# EAGLE design miniecu (EAGLE 6.5.0)
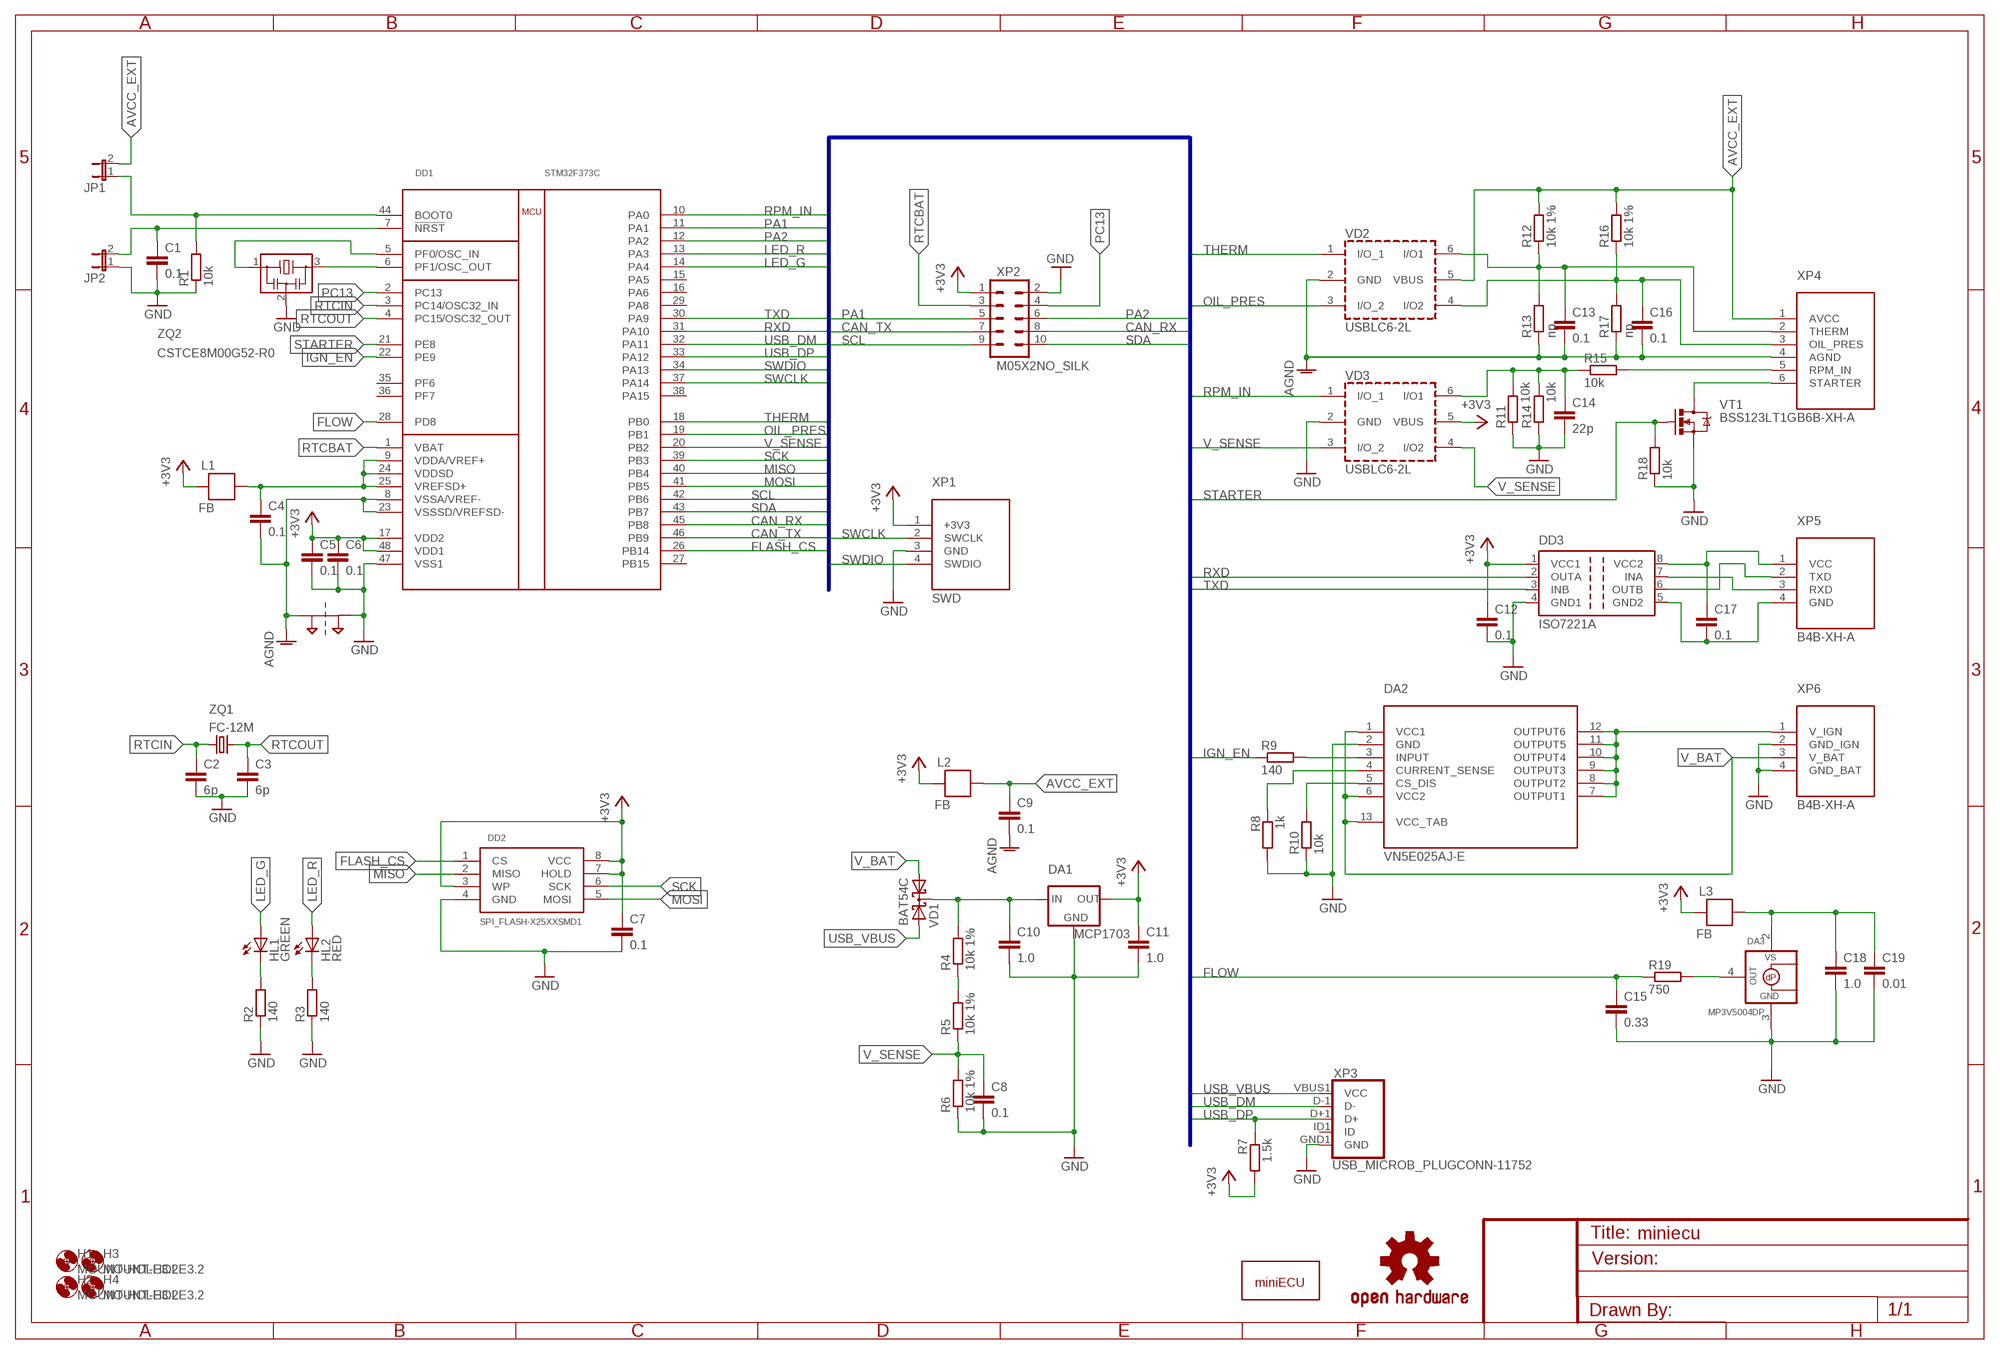
[diagram p0: schematic, sheet 1]

## Parts
C1  0.1  C-EUC0603  [C0603]
C2  6p  C-EUC0603  [C0603]
C3  6p  C-EUC0603  [C0603]
C4  0.1  C-EUC0603  [C0603]
C5  0.1  C-EUC0603  [C0603]
C6  0.1  C-EUC0603  [C0603]
C7  0.1  C-EUC0603  [C0603]
C8  0.1  C-EUC0603  [C0603]
C9  0.1  C-EUC0603  [C0603]
C10  1.0  C-EUC0805  [C0805]
C11  1.0  C-EUC0805  [C0805]
C12  0.1  C-EUC0603  [C0603]
C13  0.1  C-EUC0603  [C0603]
C14  22p  C-EUC0603  [C0603]
C15  0.33  C-EUC0603  [C0603]
C16  0.1  C-EUC0603  [C0603]
C17  0.1  C-EUC0603  [C0603]
C18  1.0  C-EUC0805  [C0805]
C19  0.01  C-EUC0603  [C0603]
DA1  MCP1703  MCP1700SOT-23  [SOT23]
DA2  VN5E025AJ-E  [POWERSSO-12]
DA3  MP3V5004DP  MPXV7025DP  [SOP8-1351]
DD1  STM32F373C  [LQFP48]
DD2  SPI_FLASH-X25XXSMD1  [SO08-EIAJ]
DD3  ISO7221A  [SO-08]
H1  MOUNT-HOLE3.2  [3,2]
H2  MOUNT-HOLE3.2  [3,2]
H3  MOUNT-HOLE3.2  [3,2]
H4  MOUNT-HOLE3.2  [3,2]
HL1  GREEN  LED-GREEN0603  [LED-0603]
HL2  RED  LED-RED0603  [LED-0603]
JP1  JUMPER-2SMD-NO  [SJ_2S-NO]
JP2  JUMPER-2SMD-NO  [SJ_2S-NO]
L1  FB  [0603]
L2  FB  [0603]
L3  FB  [0603]
LOGO1  MINIECU_LOGO  [MINIECU_LOGO]
LOGO2  OSHW-LOGOL  [OSHW-LOGO-L]
PT1  2PT_GND_TIE  [2PT_GND_TIE]
R1  10k  R-EU_R0603  [R0603]
R2  140  R-EU_R0603  [R0603]
R3  140  R-EU_R0603  [R0603]
R4  10k 1%  R-EU_R0805  [R0805]
R5  10k 1%  R-EU_R0805  [R0805]
R6  10k 1%  R-EU_R0805  [R0805]
R7  1.5k  R-EU_R0603  [R0603]
R8  1k  R-EU_R0603  [R0603]
R9  140  R-EU_R0603  [R0603]
R10  10k  R-EU_R0603  [R0603]
R11  10k  R-EU_R0603  [R0603]
R12  10k 1%  R-EU_R0805  [R0805]
R13  np  R-EU_R0805  [R0805]
R14  10k  R-EU_R0603  [R0603]
R15  10k  R-EU_R0603  [R0603]
R16  10k 1%  R-EU_R0805  [R0805]
R17  np  R-EU_R0805  [R0805]
R18  10k  R-EU_R0603  [R0603]
R19  750  R-EU_R0603  [R0603]
VD1  BAT54C  [SOT23]
VD2  USBLC6-2L  USBLC6-2SC6  [SOT-23-6L]
VD3  USBLC6-2L  USBLC6-2SC6  [SOT-23-6L]
VT1  BSS123LT1G  MOSFET-NCHANNELBSS123LT1G  [SOT23]
XP1  SWD  [1X04-1.27MM]
XP2  M05X2NO_SILK  [2X5_NOSILK]
XP3  USB_MICROB_PLUGCONN-11752  [USB-B-MICRO-SMD_V03]
XP4  B6B-XH-A  SENSORS-B6B-XH-A  [B6B-XH]
XP5  B4B-XH-A  UART-B4B-XH-A  [B4B-XH]
XP6  B4B-XH-A  IGN_POWER-B4B-XH-A  [B4B-XH]
ZQ1  FC-12M  [FC-12M]
ZQ2  CSTCE8M00G52-R0  [CSTCE]

## Nets
!NRST: C1.1 DD1.7(!NRST) JP2.2
+3V3: C5.1 C6.1 C7.1 C11.1 C12.1 DA1.2(OUT) DD1.17(VDD2) DD1.48(VDD1) DD2.3(WP) DD2.7(HOLD) DD2.8(VCC) DD3.1(VCC1) L1.2 L2.2 L3.2 R7.2 VD3.5(VBUS) XP1.1(+3V3) XP2.1
AGND: C4.2 C9.2 C13.2 C16.2 DD1.8(VSSA/VREF-) DD1.23(VSSSD/VREFSD-) PT1.P$1 R13.1 R17.1 VD2.2(GND) XP4.4(AGND)
AVCC: C4.1 DD1.9(VDDA/VREF+) DD1.24(VDDSD) DD1.25(VREFSD+) L1.1
AVCC_EXT: C9.1 JP1.2 L2.1 R12.2 R16.2 VD2.5(VBUS) XP4.1(AVCC)
AVCC_FLOW: C18.1 C19.1 DA3.2(VS) L3.1
BOOT0: DD1.44(BOOT0) JP1.1 R1.2
CAN_RX: DD1.45(PB8) XP2.8
CAN_TX: DD1.46(PB9) XP2.7
FLASH_CS: DD1.26(PB14) DD2.1(CS)
FLOW: C15.1 DD1.28(PD8) R19.1
GND: C1.2 C2.2 C3.2 C5.2 C6.2 C7.2 C8.2 C10.2 C11.2 C12.2 C14.2 C15.2 C18.2 C19.2 DA1.1(GND) DA2.2(GND) DA3.3(GND) DD1.47(VSS1) DD2.4(GND) DD3.4(GND1) JP2.1 PT1.P$2 R1.1 R2.1 R3.1 R6.1 R8.2 R10.1 R11.1 R14.1 R18.1 VD3.2(GND) VT1.2(S) XP1.3(GND) XP2.2 XP3.GND1(GND) XP6.2(GND_IGN) XP6.4(GND_BAT) ZQ2.2
GND2: C17.2 DD3.5(GND2) XP5.4(GND)
IGN_EN: DD1.22(PE9) R9.1
IORXD: DD3.7(INA) XP5.3(RXD)
IOTXD: DD3.6(OUTB) XP5.2(TXD)
LED_G: DD1.14(PA4) HL1.A
LED_R: DD1.13(PA3) HL2.A
MISO: DD1.40(PB4) DD2.2(MISO)
MOSI: DD1.41(PB5) DD2.5(MOSI)
N$1: R4.1 R5.2
N$2: DA2.4(CURRENT_SENSE) R8.1
N$3: HL2.C R3.2
N$4: DA3.4(+VOUT) R19.2
N$5: HL1.C R2.2
N$6: C10.1 DA1.3(IN) R4.2 VD1.3(CC)
N$7: DA2.3(INPUT) R9.2
N$9: DA2.5(CS_DIS) R10.2
OIL_PRES: C16.1 DD1.19(PB1) R16.1 R17.2 VD2.3(I/O_2) VD2.4(I/O2) XP4.3(OIL_PRES)
OSC_IN: DD1.5(PF0/OSC_IN) ZQ2.1
OSC_OUT: DD1.6(PF1/OSC_OUT) ZQ2.3
PA1: DD1.11(PA1) XP2.5
PA2: DD1.12(PA2) XP2.6
PC13: DD1.2(PC13) XP2.4
RPM_IN: C14.1 DD1.10(PA0) R11.2 R14.2 R15.1 VD3.1(I/O_1) VD3.6(I/O1)
RPM_IN_CON: R15.2 XP4.5(RPM_IN)
RTCBAT: DD1.1(VBAT) XP2.3
RTCIN: C2.1 DD1.3(PC14/OSC32_IN) ZQ1.1
RTCOUT: C3.1 DD1.4(PC15/OSC32_OUT) ZQ1.2
RXD: DD1.31(PA10) DD3.2(OUTA)
SCK: DD1.39(PB3) DD2.6(SCK)
SCL: DD1.42(PB6) XP2.9
SDA: DD1.43(PB7) XP2.10
STARTER: DD1.21(PE8) R18.2 VT1.1(G)
STARTER_OUT: VT1.3(D) XP4.6(STARTER)
SWCLK: DD1.37(PA14) XP1.2(SWCLK)
SWDIO: DD1.34(PA13) XP1.4(SWDIO)
THERM: C13.1 DD1.18(PB0) R12.1 R13.2 VD2.1(I/O_1) VD2.6(I/O1) XP4.2(THERM)
TXD: DD1.30(PA9) DD3.3(INB)
USB_DM: DD1.32(PA11) XP3.D-1(D-)
USB_DP: DD1.33(PA12) R7.1 XP3.D+1(D+)
USB_VBUS: VD1.2(A2) XP3.VBUS1(VCC)
V_BAT: DA2.1(VCC1) DA2.6(VCC2) DA2.13(VCC_TAB) VD1.1(A1) XP6.3(V_BAT)
V_IGN: DA2.7(OUTPUT1) DA2.8(OUTPUT2) DA2.9(OUTPUT3) DA2.10(OUTPUT4) DA2.11(OUTPUT5) DA2.12(OUTPUT6) XP6.1(V_IGN)
V_SENSE: C8.1 DD1.20(PB2) R5.1 R6.2 VD3.3(I/O_2) VD3.4(I/O2)
VCC2: C17.1 DD3.8(VCC2) XP5.1(VCC)
Unconnected: DD1.15(PA5) DD1.16(PA6) DD1.27(PB15) DD1.29(PA8) DD1.35(PF6) DD1.36(PF7) DD1.38(PA15) XP3.ID1(ID)

## Buses
TXD,RXD,RPM_IN,STARTER,THERM,OIL_PRES,MISO,MOSI,SCK,FLASH_CS,IGN_EN,V_SENSE,USB_DP,USB_DM,USB_VBUS,FLOW,SWCLK,SWDIO,LED_G,LED_R,CAN_RX,CAN_TX,SCL,SDA,PA1,PA2

## Library data of the parts
C1-C19 = resistor:C-EU: CAPACITOR, European symbol
DA1 = power-ic:MCP1700: VOLTAGE REGULATOR
DA2 = power-ic:VN5E025AJ: Single channel high-side driver with analog current sense for automotive applications Features Max supply voltage VCC 41 V Operating voltage range VCC 4.5 to 28 V Max On-State resistance RON 25 mΩ Current limitation (typ) ILIMH 60 A Off state supply current IS 2 μA
DA3 = microbuilder:MPXV7025DP: PRESSURE SENSOR - Differential Input, Single-Ended Output
DD1 = stm32f373:STM32F373C: STM32F373 ARM Cortex-M4 32b MCU+FPU, up to 256KB Flash+32KB SRAM timers, 4 ADCs (12/16-bit), 3 DACs, 2 comp., 2.0-3.6 V operation
DD2 = SparkFun-DigitalIC:SPI_FLASH-X25XX: 8pin SPI Flash series x25xx. Works with devices like W25X32 and BR25L32
DD3 = texas:ISO7221: DUAL DIGITAL ISOLATORS Source: http://focus.ti.com/lit/ds/symlink/iso7221a.pdf; MPN: ISO7221AD; OC_FARNELL: 1390651; OC_NEWARK: 48M0672
H1-H4 = holes:MOUNT-HOLE: MOUNTING HOLE with drill center marker
HL1 = SparkFun-LED:LED-GREEN: Various green LEDs 0603- DIO-00821 LARGE- DIO-00862 LILYPAD- DIO-09910; PROD_ID: DIO-00821
HL2 = SparkFun-LED:LED-RED: Assorted Red LEDs LilyPad 1206- DIO-09912 1206- DIO-00809 0603- DIO-00819; PROD_ID: DIO-00819
JP1 JP2 = SparkFun-Passives:JUMPER-2: Jumper Basic 0.1" spaced jumper. Use with breakaway headers.
L1-L3 = SparkFun-Passives:FB
LOGO1 = miniecu:MINIECU_LOGO: Logo imported from bmp.
LOGO2 = SparkFun-Aesthetics:OSHW-LOGO: Open Source Hardware Logo This logo indicates the piece of hardware it is found on incorporates a OSHW license and/or adheres to the definition of open source hardware found here: http://freedomdefined.org/OSHW
PT1 = SparkFun-Passives:2PT_GND_TIE: Package for connecting two ground nets in one place.
R1-R19 = resistor:R-EU_: RESISTOR, European symbol
VD1 = diode:BAT54C: Schottky Diodes Source: Fairchild .. BAT54.pdf
VD2 VD3 = usblc6:USBLC6-2: VERY LOW CAPACITANCE ESD PROTECTION 2 line Datasheet link <http://www.st.com/web/catalog/sense_power/FM114/CL1137/SC1489/PF93353>
VT1 = SparkFun-DiscreteSemi:MOSFET-NCHANNEL: Common NMOSFET Parts MFG P/N Store ID Prod ID FDD8780 TRANS-09984 SI7820DN TRANS-11055 FDS6630A IC-08089 2N7002PW TRANS-11151 FQP30N06L COM-10213 TRANS-10060 BSS123LT1G TRANS-08345 BSS138 TRANS-00830 BS170 2N7000; PROD_ID: TRANS-08345
XP1 = miniecu-con:SWD
XP2 = SparkFun-Connectors:M05X2: Header 5x2 Standard 10-pin dual row 0.1" header. Commonly used with AVR-ISP. Use with Spark Fun Electronics SKU: PRT-00778
XP3 = SparkFun-Connectors:USB_MICROB_PLUG: USB Micro-B Plug Comes in a variety of packages. Check out Hirose's ZX-x0 line: http://www.hirose.co.jp/cataloge_hp/e24200011.pdf; PROD_ID: CONN-11752
XP4 = miniecu-con:SENSORS: JST XH CONNECTOR JST XH connector for engine sensors
XP5 = miniecu-con:UART: JST XH CONNECTOR Connector for isolated UART
XP6 = miniecu-con:IGN_POWER: JST XH CONNECTOR Connector for ingition module power switch
ZQ1 = crystal:FC-12M: kHz RANGE CRYSTAL UNIT LOW PROFILE SMD Source: Epson Toyocom FC-12M.pdf
ZQ2 = cstce-resonator:CSTC?: Resonator CSTCR ­- 2.0 x 4.5 mm <http://search.murata.co.jp/Ceramy/CatalogAction.do?sHinnm=?&nbsp&sNHinnm=CSTCR6M00G53-R0&sNhin_key=CSTCR6M00G53-R0&sLang=en&sParam=CSTCR> CSTCE ­- 1.3 x 3.2 mm <http://search.murata.co.jp/Ceramy/CatalogAction.do?sHinnm=?&nbsp&sNHinnm=CSTCE8M00G52-R0&sNhin_key=CSTCE8M00G52-R0&sLang=en&sParam=CSTCE>; FREQUENCY: 8 MHz; OC_MOUSER: 81-CSTCE8M00G52-R0

## Board
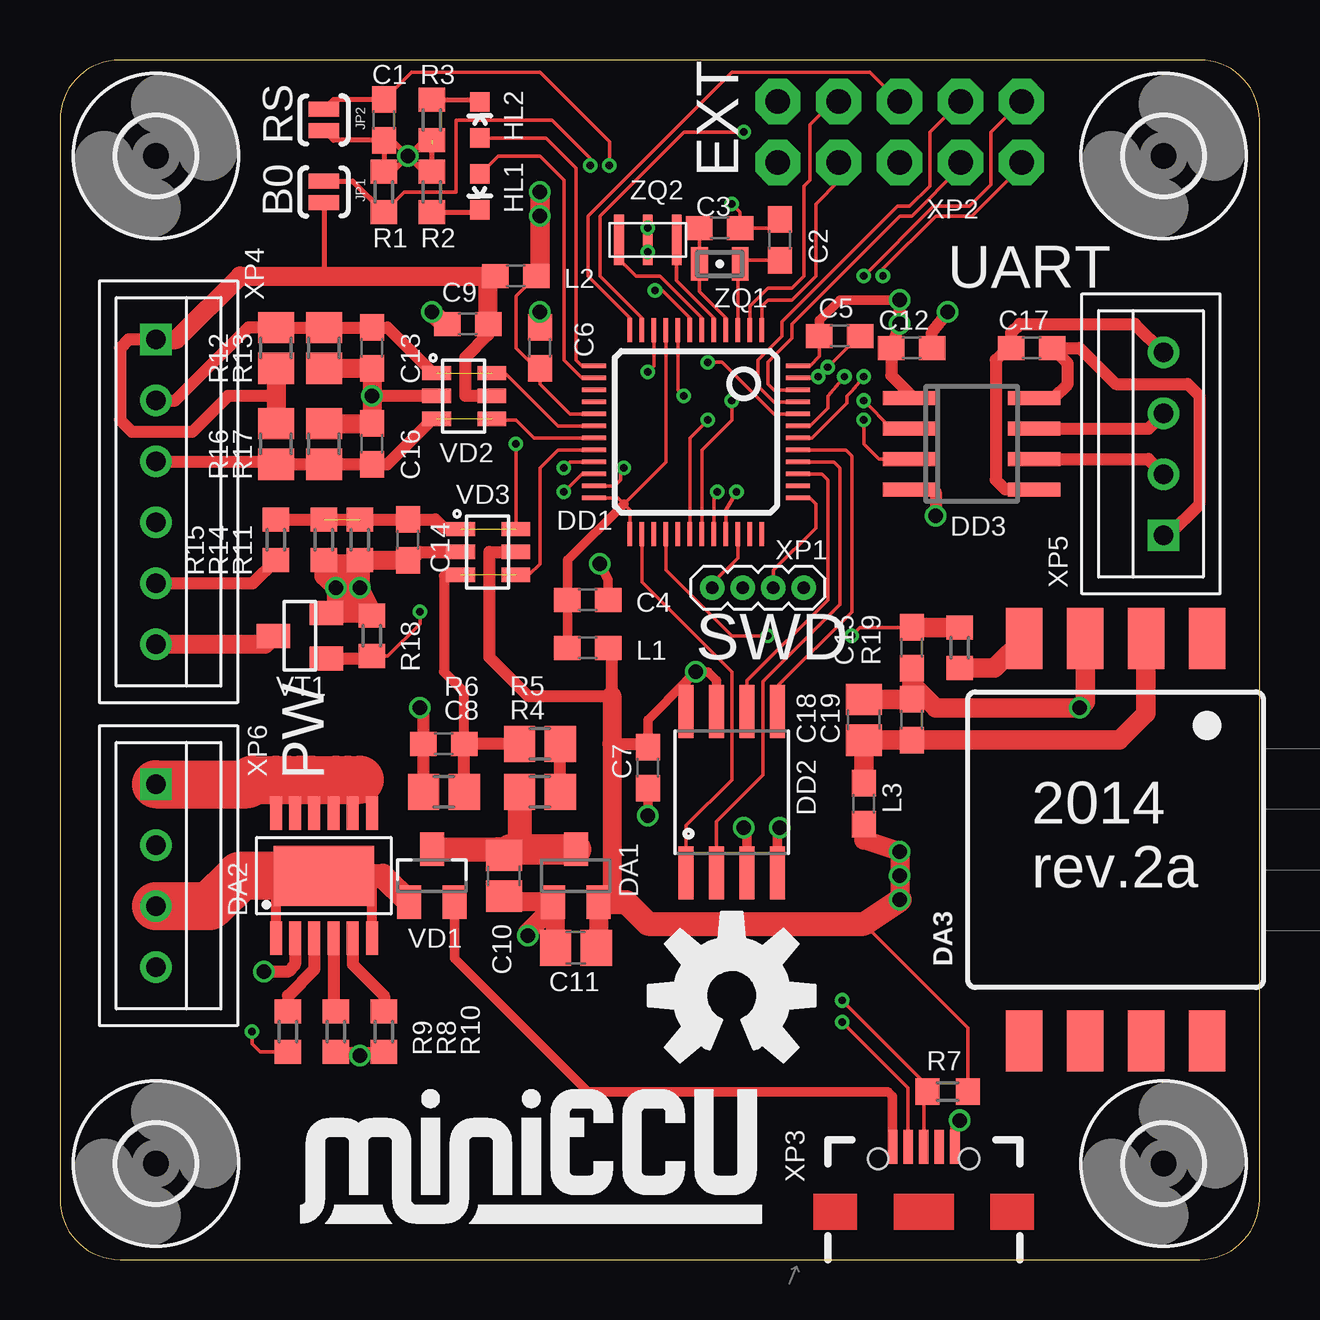
[diagram p1: board, top side]
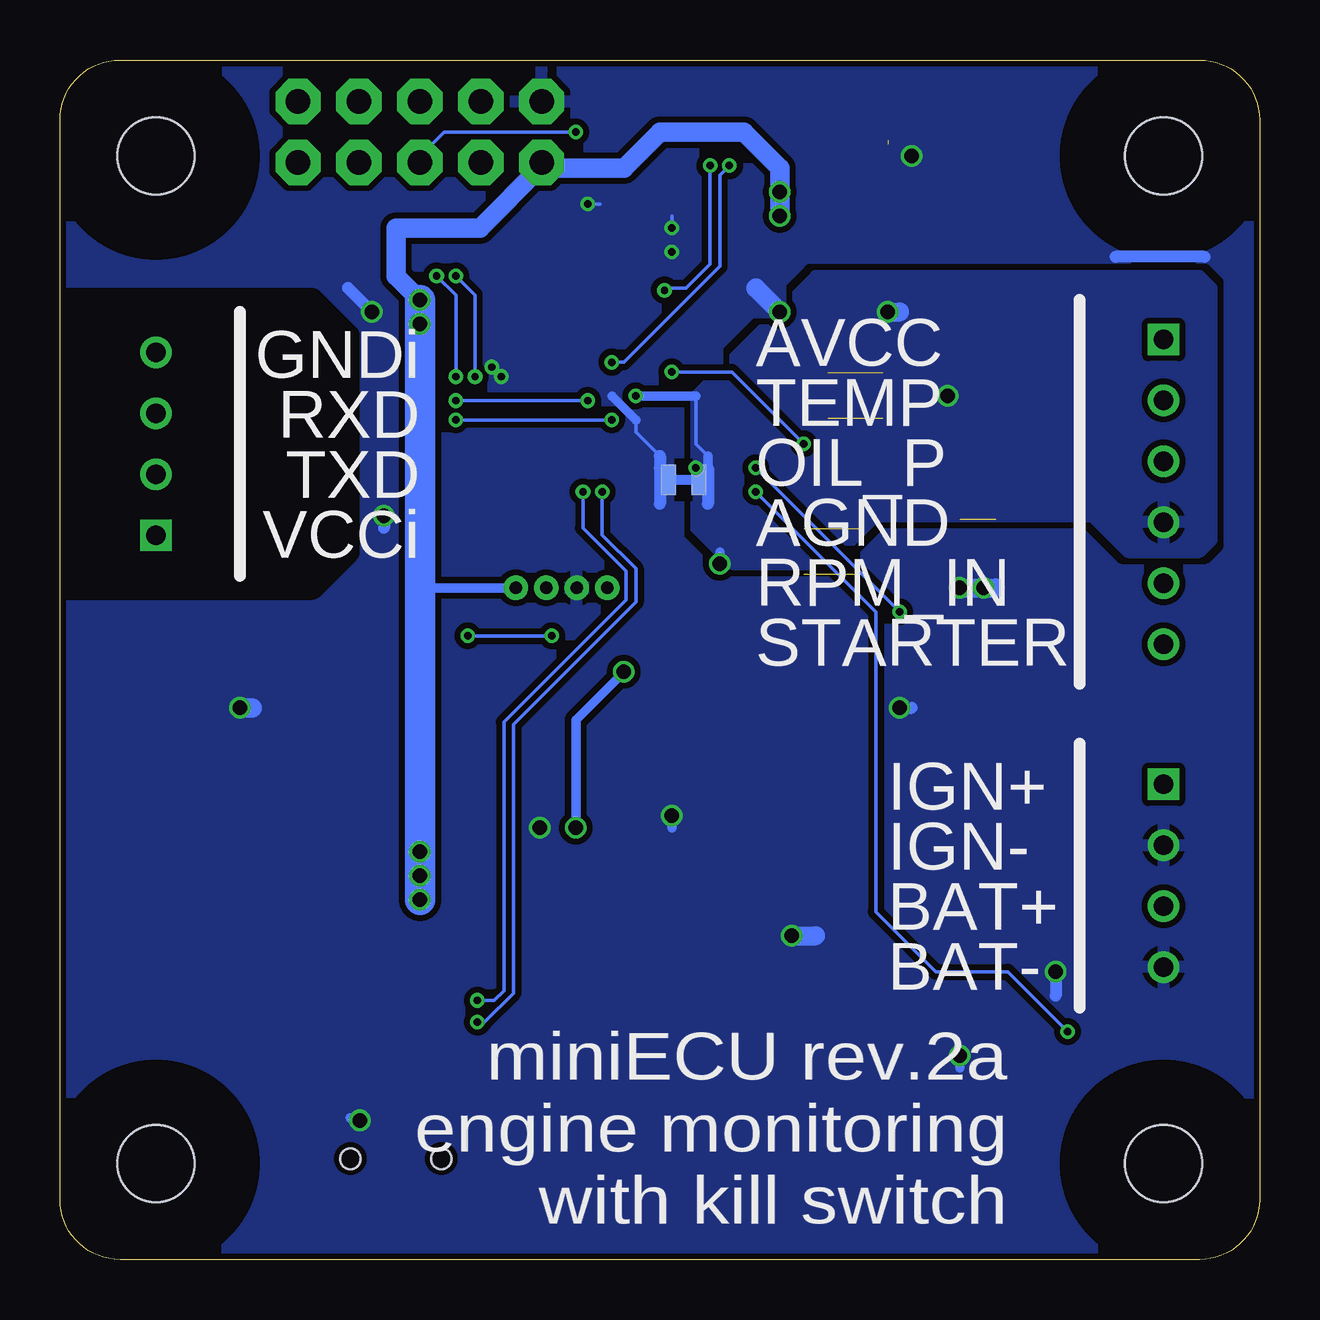
[diagram p2: board, bottom side, seen from below]

Size 50 x 50 mm. Coordinates in mm from the lower left corner, seen from the top.
Outline: 0,2.5 arc90 2.5,0 47.5,0 arc90 50,2.5 50,47.5 arc90 47.5,50 2.5,50 arc90 0,47.5 0,2.5
Copper layers (1*16): Top 0.035mm / dielectric 1.5mm / Bottom 0.035mm
Design rules "ITEADstudio_DRC": minimum track width 6mil, minimum drill 12mil, track to track 6mil, track to pad 6mil, pad to pad 6mil, via to via 6mil, smd to smd 0mil, copper to edge 10mil, drill to drill 10mil, minimum pad ring 10mil, minimum via ring 6mil, stop-mask expansion 2mil, vias tented up to drill 100mil, thermal gap 10mil
bRestrict: area 38,28 to 50,40

### Footprints (pad centres in the part's own frame; a part is rotated, then mirrored left to right if it is on the bottom)
C0603 = smd 1.1 x 1: 1 -0.85,0; 2 0.85,0
C0805 = smd 1.3 x 1.5: 1 -0.85,0; 2 0.85,0
SOT23 = smd 1 x 1.4: 1 -0.95,-1.1; 2 0.95,-1.1; 3 0,1.1
POWERSSO-12 = smd 0.5 x 1.4: 1 -2,-2.6; 2 -1.2,-2.6; 3 -0.4,-2.6; 4 0.4,-2.6; 5 1.2,-2.6; 6 2,-2.6; 7 2,2.6; 8 1.2,2.6; 9 0.4,2.6; 10 -0.4,2.6; 11 -1.2,2.6; 12 -2,2.6 | smd 4.2 x 2.5: 13 0,0
SOP8-1351 = smd 2.54 x 1.524: 1 -8.382,3.81; 2 -8.382,1.27; 3 -8.382,-1.27; 4 -8.382,-3.81; 5 8.382,-3.81; 6 8.382,-1.27; 7 8.382,1.27; 8 8.382,3.81
LQFP48 = smd 0.2 x 1: 1 -2.75,-4.25; 2 -2.25,-4.25; 3 -1.75,-4.25; 4 -1.25,-4.25; 5 -0.75,-4.25; 6 -0.25,-4.25; 7 0.25,-4.25; 8 0.75,-4.25; 9 1.25,-4.25; 10 1.75,-4.25; 11 2.25,-4.25; 12 2.75,-4.25; 25 2.75,4.25; 26 2.25,4.25; 27 1.75,4.25; 28 1.25,4.25; 29 0.75,4.25; 30 0.25,4.25; 31 -0.25,4.25; 32 -0.75,4.25; 33 -1.25,4.25; 34 -1.75,4.25; 35 -2.25,4.25; 36 -2.75,4.25 | smd 1 x 0.2: 13 4.25,-2.75; 14 4.25,-2.25; 15 4.25,-1.75; 16 4.25,-1.25; 17 4.25,-0.75; 18 4.25,-0.25; 19 4.25,0.25; 20 4.25,0.75; 21 4.25,1.25; 22 4.25,1.75; 23 4.25,2.25; 24 4.25,2.75; 37 -4.25,2.75; 38 -4.25,2.25; 39 -4.25,1.75; 40 -4.25,1.25; 41 -4.25,0.75; 42 -4.25,0.25; 43 -4.25,-0.25; 44 -4.25,-0.75; 45 -4.25,-1.25; 46 -4.25,-1.75; 47 -4.25,-2.25; 48 -4.25,-2.75
SO08-EIAJ = smd 0.61 x 2.21: 1 -1.905,-3.378; 2 -0.635,-3.378; 3 0.635,-3.378; 4 1.905,-3.378; 5 1.905,3.353; 6 0.635,3.353; 7 -0.635,3.353; 8 -1.905,3.353
SO-08 = smd 0.6 x 2.2: 1 -1.905,-2.6; 2 -0.635,-2.6; 3 0.635,-2.6; 4 1.905,-2.6; 5 1.905,2.6; 6 0.635,2.6; 7 -0.635,2.6; 8 -1.905,2.6
3,2 = hole 3.2: 0,0
LED-0603 = smd 0.8 x 0.8: A 0,-0.75; C 0,0.75
SJ_2S-NO = smd 0.635 x 1.27: 1 -0.45,0; 2 0.45,0
0603 = smd 1.1 x 1: 1 -0.85,0; 2 0.85,0
2PT_GND_TIE = smd 1.27 x 0.635: P$1 0,0.635; P$2 0,-0.635
R0603 = smd 1 x 1.1: 1 -0.85,0; 2 0.85,0
R0805 = smd 1.3 x 1.5: 1 -0.85,0; 2 0.85,0
SOT-23-6L = smd 0.6 x 1.2: 1 -0.95,-2.3; 2 0,-2.3; 3 0.95,-2.3; 4 0.95,0; 5 0,0; 6 -0.95,0
1X04-1.27MM = drill 0.508 pad 1: 1 0,0; 2 1.27,0; 3 2.54,0; 4 3.81,0
2X5_NOSILK = drill 1.016 pad 1.88 octagon: 1 -1.27,5.08; 2 1.27,5.08; 3 -1.27,2.54; 4 1.27,2.54; 5 -1.27,0; 6 1.27,0; 7 -1.27,-2.54; 8 1.27,-2.54; 9 -1.27,-5.08; 10 1.27,-5.08
USB-B-MICRO-SMD_V03 = smd 1.4 x 0.4: D+1 2.7,0; D-1 2.7,0.65; GND1 2.7,-1.3; ID1 2.7,-0.65; VBUS1 2.7,1.3 | hole 0.85: 2.2,1.9; 2.2,-1.9
B6B-XH = drill 0.8 square: 1 -6.35,0 | drill 0.8: 2 -3.81,0; 3 -1.27,0; 4 1.27,0; 5 3.81,0; 6 6.35,0
B4B-XH = drill 0.8 square: 1 -3.81,0 | drill 0.8: 2 -1.27,0; 3 1.27,0; 4 3.81,0
FC-12M = smd 0.7 x 1.4: 1 -0.85,0; 2 0.85,0
CSTCE = smd 0.4 x 2.1: 1 -1.2,0; 2 0,0; 3 1.2,0

### Placement (x,y rotation side)
C1  13.5,47.5 270 top
C2  30,42.5 90 top
C3  27.5,43 0 top
C4  22,27.5 0 top
C5  32.5,38.5 0 top
C6  20,38 90 top
C7  24.5,20.5 270 top
C8  16,21.5 180 top
C9  17,39 180 top
C10  18.5,16 270 top
C11  21.5,13 180 top
C12  35.5,38 0 top
C13  13,38 270 top
C14  14.5,30 270 top
C15  35.5,25.5 270 top
C16  13,34 90 top
C17  40.5,38 180 top
C18  33.5,22.5 90 top
C19  35.5,22.5 90 top
DA1  21.5,16 0 top
DA2  11,16 0 top
DA3  44,17.5 270 top
DD1  26.5,34.5 180 top
DD2  28,19.5 0 top
DD3  38,34 270 top
H1  46,4 0 top
H2  4,4 0 top
H3  4,46 0 top
H4  46,46 0 top
HL1  17.5,44.5 180 top
HL2  17.5,47.5 0 top
JP1  11,44.5 270 top
JP2  11,47.5 90 top
L1  22,25.5 0 top
L2  19,41 0 top
L3  33.5,19 270 top
LOGO1  10,1.5 0 top
LOGO2  28,11 0 top
PT1  24,32.5 270 bottom
R1  13.5,44.5 270 top
R2  15.5,44.5 270 top
R3  15.5,47.5 90 top
R4  20,19.5 180 top
R5  20,21.5 0 top
R6  16,19.5 0 top
R7  37,7 0 top
R8  11.5,9.5 270 top
R9  9.5,9.5 90 top
R10  13.5,9.5 90 top
R11  12.5,30 90 top
R12  9,38 270 top
R13  11,38 90 top
R14  11,30 90 top
R15  9,30 270 top
R16  9,34 90 top
R17  11,34 270 top
R18  13,26 270 top
R19  37.5,25.5 270 top
VD1  15.5,16 0 top
VD2  18,36 270 top
VD3  19,29.5 270 top
VT1  10,26 90 top
XP1  31,28 180 top
XP2  35,47 90 top
XP3  36,2 90 top
XP4  4,32 270 top
XP5  46,34 90 top
XP6  4,16 270 top
ZQ1  27.5,41.5 180 top
ZQ2  24.5,42.5 180 top

### Tracks (layer width: path | path; a pad name or v marks a point on that pad's centre or on a via)
!NRST  (via drill 0.3)
  Top 0.152: DD1.7 26.25,39.25 25,40.5 v24.8,40.4 | 13.65,48.5 C1.1 14.65,49.5 20,49.5 22.9,46.6 v22.9,45.6
  Top 0.2: C1.1 11.4,48.35 JP2.2
  Bottom 0.152: v24.8,40.4 24.8,40.5 23.9,40.5 22.9,41.5 v22.9,45.6
+3V3  (via drill 0.6)
  Top 0.152: DD1.17 21.25,35.25 20,36.5 C6.1 19.85,37.15 19,38 19,40.15 L2.2 | DD1.48 31.25,37.25 31.65,37.65 C5.1 | R7.2 37.85,9.65 33.5,14
  Top 0.4: DD2.8 26.09,24.09 | DD2.7 27.36,24.14 27,24.5 v26.5,24.5 26.09,24.09 | C7.1 24.5,22.5 26.09,24.09 | DD2.3 28.64,17.86 v28.5,18 | C5.1 31.65,39.15 32.5,40 v35,40
  Top 0.5: VD3.5 17.9,29.5 17.9,25.1 19.5,23.5 23,23.5 23,25.35 L1.2 | DD3.1 35.4,36.1 34.65,36.85 C12.1 v35,39 v35,40 | 23,21.5 24.35,21.5 C7.1
  Top 0.8: DA1.2 22.45,13.1 C11.1 | v35,15 v35,16 v35,17 33.5,17.5 | 23,14.9 23,21.5 23,23.5
  Top 0.813: L3.2 33.5,17.5 | v20,44.5 20,41 L2.2
  Top 1: DA1.2 23,14.9 23.6,14.9 24.5,14 33.5,14 v35,15
  Bottom 0.4: XP1.1 35,28 | v28.5,18 28.5,22.5 v26.5,24.5
  Bottom 0.813: v35,40 36,41 36,43 32.5,43 29.92,45.58 | XP2.1 29.69,45.5 26.5,45.5 25,47 21.5,47 20,45.5 v20,44.5 v20,43.5
  Bottom 1.27: v35,15 v35,16 v35,17 35,28 v35,39 v35,40 | XP2.1 29.92,45.58
AGND  (via drill 0.3, 0.6)
  Top 0.152: DD1.23 23.11,32.25 PT1.P$1 23.36,32.87 v23.5,33 | DD1.8 25.75,36.25 v26,36
  Top 0.4: C4.2 22.85,28.35 v22.5,29
  Top 0.5: VD2.2 v13,36
  Top 0.8: R13.1 C13.2 v13,36 C16.2 R17.1 | C9.2 16,39 v15.5,39.5
  Bottom 0.152: 23.5,32 23.5,32.37 PT1.P$1 23.5,32.63 v23.5,33 23,33 | 23.5,36 23.5,34 23,33.5
  Bottom 0.4: v22.5,29 22.5,29.5 | 23,33.5 23,33 | v26,36 23.5,36
  Bottom 0.5: 23,33 23,31.5
  Bottom 0.8: v15.5,39.5 15,39.5
  pour Bottom (isolate 0.254): 5.5,29.5 2.5,29.5 2,30 2,40.5 2.5,41 18.5,41 23.5,36 23.5,30.5 22,29 18,29 16,31 7,31
AVCC
  Top 0.152: DD1.24 23.25,31.75 23.5,31.5 | DD1.25 23.75,31.25 23.5,31.5 | DD1.9 25.25,33.25 23.5,31.5
  Top 0.4: 23.5,31.5 21.15,29.15 C4.1 L1.1
AVCC_EXT
  Top 0.2: JP1.2 11,41
  Top 0.5: VD2.5 16.9,36 16.9,37.6 17.85,38.55 C9.1 | 9,36 7,36 5.5,34.5 3,34.5 2.5,35 2.5,38 2.85,38.35 XP4.1
  Top 0.8: R12.2 9,36 R16.2 | XP4.1 4.85,38.35 7.5,41 11,41 L2.1 17.85,40.7 C9.1
AVCC_FLOW
  Top 0.813: L3.1 C18.1 C19.1 44.15,21.65 45.27,22.77 DA3.2
BOOT0  (via drill 0.3)
  Top 0.152: DD1.44 29.75,35.25 27.6,37.4 v27,37.4 | R1.2 14.35,44.5 16.5,44.5 16.5,47.5 20.5,47.5 22.1,45.9 v22.1,45.6
  Top 0.2: JP1.1 12.2,44.95 R1.2
  Bottom 0.152: v27,37.4 26.5,37.4 22.5,41.4 22.5,45.2 v22.1,45.6
CAN_RX
  Top 0.152: DD1.45 29.75,35.75 29.1,36.4 29.1,37.5 30.1,38.5 30.1,39.1 34.9,43.9 35.4,43.9 36.25,44.75 36.25,47 37.52,48.27 XP2.8
CAN_TX
  Top 0.152: DD1.46 29.75,36.25 29.5,36.5 29.5,37.4 30.5,38.4 30.5,39 35,43.5 35.5,43.5 37.54,45.54 XP2.7
FLASH_CS
  Top 0.152: DD1.26 24.25,28.25 28,24.5 28,20 26.09,18.09 DD2.1
FLOW  (via drill 0.3)
  Top 0.152: C15.1 33.35,26.35 v33,26 | DD1.28 25.25,28.75 28,26 v29.5,26
  Top 0.813: R19.1 C15.1
  Bottom 0.152: v33,26 v29.5,26
GND  (via drill 0.3, 0.6)  (1 unrouted)
  Top 0.152: C2.2 29.65,43 C3.2 28.35,43.65 v28,44 | ZQ2.2 v24.5,43 | DD1.47 31.55,36.75 v31.6,36.8 v32,37.2 33.3,38.5 C5.2
  Top 0.2: C1.2 11.4,46.65 JP2.1 | C1.2 13.5,45.5 | 13.5,45.5 R1.1 | C1.2 13.85,46.65 v14.5,46 | 13.5,45.5 14,45.5 v14.5,46 | R3.1 15.15,46.65 v14.5,46 | R2.1 15.15,45.35 v14.5,46 | 15.5,45.5 15.5,46.5
  Top 0.4: R8.2 12.35,8.65 v12.5,8.5 12.65,8.65 R10.1 | DD2.4 29.91,17.59 v30,18 | C7.2 v24.5,18.5 | XP3.GND1 37.3,5.6 v37.5,5.8
  Top 0.5: C14.2 14.15,29 14.5,29 15,29.5 VD3.2 | C8.2 R6.1 15.15,22.85 v15,23 | DA2.2 9.8,12.3 9.5,12 v8.5,12 | C12.2 36.35,38.65 v37,39.5 | DD3.4 36.41,32.09 36.5,32 v36.5,31
  Top 0.8: v12.5,28 12.5,29 R11.1 C14.2 | VT1.2 12.9,26.95 R18.1 13,27 | 13,27 v12.5,28 | C11.2 20.65,14.8 | 20.65,14.8 DA1.1 18.75,14.9 C10.2 | 20.65,14.8 19.5,13.65 v19.5,13.5 | v11.5,28 11.5,27 | v11.5,28 12,29 | v11.5,28 v12.5,28 | v11.5,28 13,27
  Top 0.813: R14.1 11,29 | 11,29 11,28.5 v11.5,28 | 11,29 12.5,29 | DA3.3 42.73,23.23 v42.5,23 36.5,23 35.5,24 C15.2 C19.2 C18.2 | C6.2 v20,39.5
  Bottom 0.152: PT1.P$2 25,33 | v24.5,43 24.5,43.5 | v28,44 27.5,44 | 26,35 26,34.5 25,33.5
  Bottom 0.4: v12.5,8.5 12.5,8 | v24.5,18.5 24.5,18 | 26,35 27,36 | v37.5,5.8 37.8,5.8 37.9,5.9
  Bottom 0.5: v15,23 14.5,23 | v8.5,12 8.5,11 | v37,39.5 38,40.5 | 25,33.5 25,33 25,31.5 | v36.5,31 36.5,30.5 | 2.3,41.8 6,41.8
  Bottom 0.8: v12.5,28 11,28 | v19.5,13.5 18.5,13.5
  Bottom 0.813: v42.5,23 42,23 | v20,39.5 21,40.5
  other vias: 24.5,42
  pour Bottom (isolate 0.254, rank 2): 2.5,50 47.5,50 arc-90 50,47.5 50,2.5 arc-90 47.5,0 2.5,0 arc-90 0,2.5 0,47.5 arc-90
GND2
  Top 0.5: XP5.4 44.81,39 40,39 39.65,38.65 C17.2 39.5,38 39,37.5 39,32.5 39.41,32.09 DD3.5
IGN_EN  (via drill 0.3)
  Top 0.152: DD1.22 21.75,32.75 v21,32 | v8,9.5 8,9 8.35,8.65 R9.1
  Bottom 0.152: v21,32 16,27 16,14.5 13.5,12 10.5,12 v8,9.5
IORXD
  Top 0.5: DD3.7 45.37,34.63 XP5.3
IOTXD
  Top 0.5: DD3.6 45.37,33.37 XP5.2
LED_G
  Top 0.152: DD1.14 21.75,36.75 21,37.5 21,45 20,46 18.25,46 HL1.A
LED_R
  Top 0.152: DD1.13 21.75,37.25 21.5,37.5 21.5,45.5 20.25,46.75 HL2.A
MISO
  Top 0.152: DD1.40 32.25,33.25 32.5,33 32.5,27.3 29.3,24.1 29.3,20.2 27.36,18.27 DD2.2
MOSI
  Top 0.152: DD1.41 32.75,33.75 33,33.5 33,27 29.91,23.91 DD2.5
N$1
  Top 0.5: R4.1 R5.2
N$2
  Top 0.5: DA2.4 11.4,10.45 R8.1
N$3
  Top 0.2: R3.2 17.4,48.35 HL2.C
N$4
  Top 0.813: R19.2 38.96,24.65 DA3.4
N$5
  Top 0.2: R2.2 17.4,43.65 HL1.C
N$6
  Top 0.8: 18.75,17.1 C10.1
  Top 1: VD1.3 18.25,17.1 C10.1 19.15,17.5 R4.2
  Top 1.27: DA1.3 18.75,17.1
N$7
  Top 0.5: DA2.3 10.6,12.1 9.5,11 R9.2
N$9
  Top 0.5: DA2.5 12.2,12.3 13.5,11 R10.2
OIL_PRES  (1 unrouted)
  Top 0.152: DD1.19 19.75,34.25 19,35 18.05,35 VD2.4
  Top 0.5: XP4.3 8.88,33.27 | R16.1 R17.2 C16.1 13.65,33.15 15.55,35.05 VD2.3
  Top 0.8: 8.88,33.27 R16.1
OSC_IN
  Top 0.152: DD1.5 27.25,39.25 25.7,40.8 ZQ2.1
OSC_OUT
  Top 0.152: DD1.6 26.75,39.25 25,41 24,41 23.3,41.7 ZQ2.3
PA1  (via drill 0.3)
  Top 0.152: DD1.11 24.25,39.25 22.5,41 22.5,43.5 26,47 v28.5,47
  Bottom 0.152: XP2.5 35,46 34,47 v28.5,47
PA2
  Top 0.152: DD1.12 23.75,39.25 22,41 22,43.5 28,49.5 33.77,49.5 XP2.6
PC13
  Top 0.152: DD1.2 28.75,39.75 29.5,40.5 30.5,40.5 31,41 31,44.75 31.25,45 31.25,47.31 32.21,48.27 XP2.4
RPM_IN  (via drill 0.3)  (2 unrouted)
  Top 0.152: DD1.10 24.75,37.25 v24.5,37 | v19,34 VD3.6
  Top 0.5: R15.1 R11.2 C14.1 15.65,30.85 16,30.5 16.65,30.5 VD3.1
  Bottom 0.152: v24.5,37 22,37 v19,34
RPM_IN_CON
  Top 0.5: XP4.5 8.04,28.19 R15.2
RTCBAT
  Top 0.152: DD1.1 29.25,39.75 29.5,40 30.5,40 31.5,41 31.5,44 32.46,44.96 XP2.3
RTCIN
  Top 0.152: DD1.3 28.25,41.4 ZQ1.1 28.5,41.65 C2.1
RTCOUT
  Top 0.152: DD1.4 27.75,39.25 26.65,40.35 ZQ1.2 C3.1
RXD  (via drill 0.3)
  Top 0.152: DD1.31 26.75,33.75 28,35 v28,35.8 | DD3.2 34.66,34.63 v33.5,35.8
  Bottom 0.152: v28,35.8 v33.5,35.8
SCK
  Top 0.152: DD1.39 31.75,32.75 32,32.5 32,27.5 28.64,24.14 DD2.6
SCL  (via drill 0.3)
  Top 0.152: v33.5,36.8 33,36.2 32.8,36 32.8,35.7 31.35,34.25 DD1.42 | v34.3,41 34.3,41.3 36.5,43.5 38,43.5 39.5,45 39.5,45.15 XP2.9
  Bottom 0.152: v33.5,36.8 33.5,40.2 v34.3,41
SDA  (via drill 0.3)
  Top 0.152: DD1.43 31.25,34.75 32,35.5 32,36 v32.7,36.8 | v33.5,41 36.4,43.9 37.9,43.9 38.8,44.8 38.8,47 XP2.10
  Bottom 0.152: v32.7,36.8 32.7,40.2 v33.5,41
STARTER  (via drill 0.3)
  Top 0.152: DD1.21 21.25,33.25 v21,33 | v15,27 15,26.5 13.65,25.15 R18.2
  Top 0.5: VT1.1 12.9,25.05 R18.2
  Bottom 0.152: v21,33 v15,27
STARTER_OUT
  Top 0.8: XP4.6 8.55,25.65 VT1.3
SWCLK
  Top 0.152: DD1.37 31.25,31.75 31.5,31.5 31.5,30.5 29.73,28.73 XP1.2
SWDIO
  Top 0.152: DD1.34 28.25,29.25 27.19,28.19 XP1.4
THERM  (1 unrouted)
  Top 0.152: VD2.6 18.55,36.95 20.75,34.75 DD1.18
  Top 0.5: XP4.2 4.81,35.81 7.85,38.85 R12.1 R13.2 C13.1 13.65,38.85 15.55,36.95 VD2.1
TXD  (via drill 0.3)
  Top 0.152: DD1.30 26.25,34.25 v27,35 | v33.5,35 33.5,34 34.13,33.37 DD3.3
  Bottom 0.152: v27,35 v33.5,35
USB_DM  (via drill 0.3)
  Top 0.152: DD1.32 27.25,31.75 v27.4,32 | XP3.D-1 35.35,7.15 v32.6,9.9
  Bottom 0.152: v27.4,32 27.4,30.2 26,28.8 26,27.4 31.1,22.3 31.1,11.1 32.3,9.9 v32.6,9.9
USB_DP  (via drill 0.3)
  Top 0.152: DD1.33 27.75,31.25 v28.2,32 | XP3.D+1 36,6.85 R7.1 36.15,7.25 v32.6,10.8
  Bottom 0.152: v28.2,32 28.2,30.5 26.4,28.7 26.4,27.5 31.5,22.4 31.5,11.2 31.9,10.8 v32.6,10.8
USB_VBUS
  Top 0.4: XP3.VBUS1 34.7,6.8 34.5,7 22,7 16.45,12.55 VD1.2
V_BAT
  Top 0.406: DA2.1 9,16 | DA2.6 13,16
  Top 1: DA2.13 13,16 13.45,16 VD1.1
  Top 2: XP6.3 6.23,14.73 7.5,16 9,16 DA2.13
V_IGN
  Top 0.5: DA2.7 13,19.5 12.5,20 | DA2.8 12.2,19.8 12,20 | DA2.9 11.4,19.9 11.5,20 | DA2.10 10.6,19.9 10.5,20 | 10,20 9.8,19.8 DA2.11 9.8,19.7 9.5,20 | DA2.12 9,20
  Top 2: XP6.1 7.81,19.81 8,20 9,20 9.5,20 10,20 10.5,20 11.5,20 12,20 12.5,20
V_SENSE  (1 unrouted)
  Top 0.152: VD3.4 19.55,28.55 20,29 20,33 20.75,33.75 DD1.20
  Top 0.406: VD3.3 16.05,28.55 16,28.5 16,24.5 16.85,23.65 C8.1
  Top 0.5: R6.2 C8.1 | 16.7,21.65 C8.1 | R5.1 C8.1
VCC2
  Top 0.5: XP5.1 46.19,30.19 47.5,31.5 47.5,36 47,36.5 44,36.5 42.5,38 C17.1 42,37.35 42,36.5 41.41,35.91 DD3.8

### Text on the board
tPlace: UART | SWD | PW | 2014 / rev.2a
bPlace: AVCC | GNDi | TEMP | RXD | OIL_P | TXD | AGND | VCCi | RPM_IN | STARTER | IGN+ | IGN- | BAT+ | BAT- | miniECU rev.2a / engine monitoring / with kill switch
tSilk: EXT
_tsilk: RS | B0